# EAGLE design Transmitter (EAGLE 6.6.0)
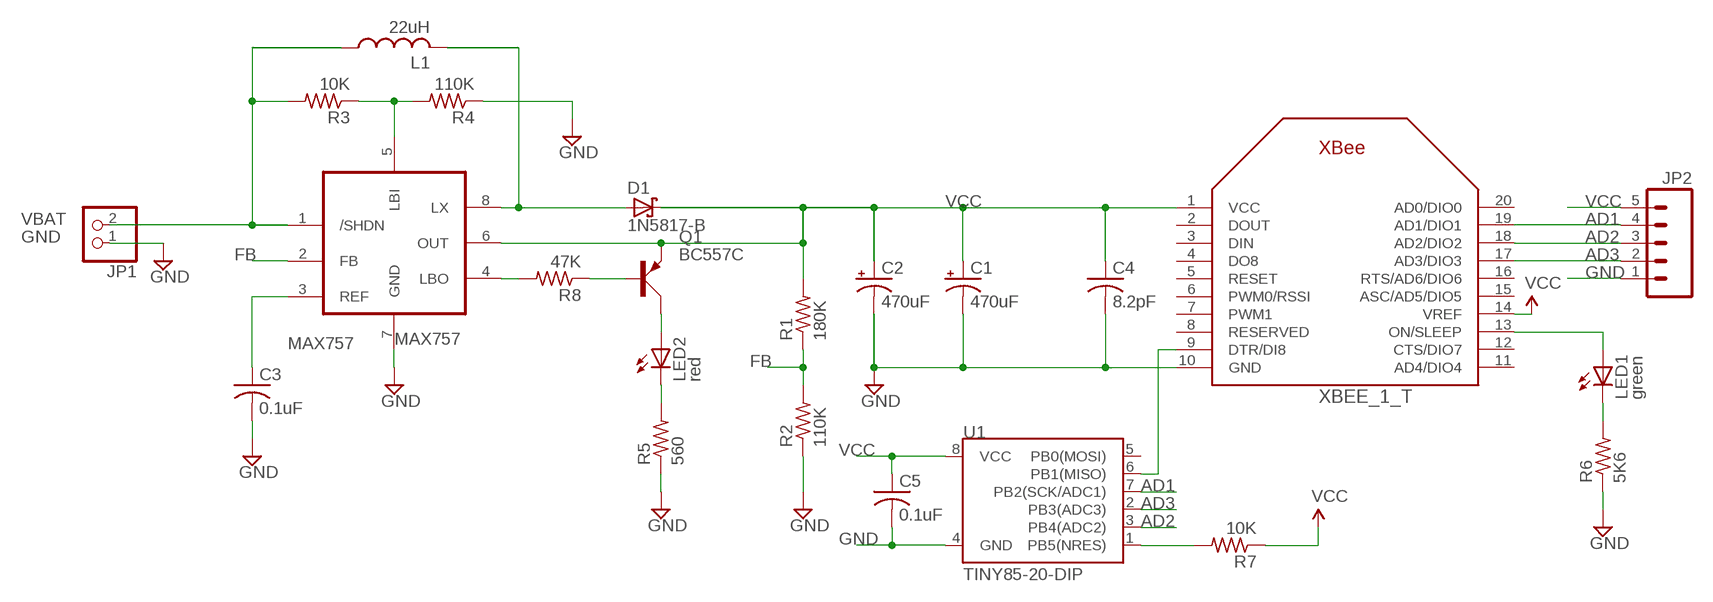
[diagram p0: schematic, sheet 1]

## Parts
C1  470uF  CPOL-USE3.5-8  [E3,5-8]
C2  470uF  CPOL-USE3.5-8  [E3,5-8]
C3  0.1uF  C-US025-024X044  [C025-024X044]
C4  8.2pF  C-US025-024X044  [C025-024X044]
C5  0.1uF  C-US025-024X044  [C025-024X044]
D1  1N5817-B  [DO41-7.6]
JP1  PINHD-1X2  [1X02]
JP2  M05PTH  [1X05]
L1  22uH  22R223C  [22R223C]
LED1  green  LED3MM  [LED3MM]
LED2  red  LED3MM  [LED3MM]
MAX757  MAX757  [DIL08]
Q1  BC557C  [TO92D]
R1  180K  R-US_0207/10  [0207/10]
R2  110K  R-US_0207/10  [0207/10]
R3  10K  R-US_0207/10  [0207/10]
R4  110K  R-US_0207/10  [0207/10]
R5  560  R-US_0207/10  [0207/10]
R6  5K6  R-US_0207/10  [0207/10]
R7  10K  R-US_0207/10  [0207/10]
R8  47K  R-US_0207/10  [0207/10]
U1  TINY85-20-DIP  ATTINY45TINY85-20-DIP  [DIP08]
XBEE_1_T  XBEE  [XBEE]

## Nets
AD1: JP2.4 U1.7(PB2(SCK/ADC1)) XBEE_1_T.19(AD1/DIO1)
AD2: JP2.3 U1.3(PB4(ADC2)) XBEE_1_T.18(AD2/DIO2)
AD3: JP2.2 U1.2(PB3(ADC3)) XBEE_1_T.17(AD3/DIO3)
FB: MAX757.2(FB) R1.1 R2.2
GND [power]: C1.- C2.- C3.2 C4.2 C5.2 JP1.1 JP2.1 MAX757.7(GND) R2.1 R4.1 R5.1 R6.1 U1.4(GND) XBEE_1_T.10(GND)
N$1: U1.6(PB1(MISO)) XBEE_1_T.9(DTR/DI8)
N$2: MAX757.4(LBO) R8.2
N$3: LED2.K(C) R5.2
N$4: LED1.A XBEE_1_T.13(ON/SLEEP)
N$5: LED1.K(C) R6.2
N$6: MAX757.5(LBI) R3.1 R4.2
N$7: D1.A L1.P$2 MAX757.8(LX)
N$8: C3.1 MAX757.3(REF)
N$9: Q1.B R8.1
N$10: R7.2 U1.1(PB5(NRES))
N$11: LED2.A Q1.C
VBAT [power]: JP1.2 L1.P$1 MAX757.1(/SHDN) R3.2
VCC [power]: C1.+ C2.+ C4.1 C5.1 D1.C JP2.5 MAX757.6(OUT) Q1.E R1.2 R7.1 U1.8(VCC) XBEE_1_T.1(VCC) XBEE_1_T.14(VREF)
Unconnected: U1.5(PB0(MOSI)) XBEE_1_T.2(DOUT) XBEE_1_T.3(DIN) XBEE_1_T.4(DO8) XBEE_1_T.5(RESET) XBEE_1_T.6(PWM0/RSSI) XBEE_1_T.7(PWM1) XBEE_1_T.8(RESERVED) XBEE_1_T.11(AD4/DIO4) XBEE_1_T.12(CTS/DIO7) XBEE_1_T.15(ASC/AD5/DIO5) XBEE_1_T.16(RTS/AD6/DIO6) XBEE_1_T.20(AD0/DIO0)

## Library data of the parts
C1 C2 = adafruit:CPOL-US: POLARIZED CAPACITOR, American symbol
C3-C5 = adafruit:C-US: CAPACITOR, American symbol
D1 = diode:1N581*: 1.0A SCHOTTKY BARRIER RECTIFIER Source: http://www.diodes.com/datasheets/ds23001.pdf
JP1 = pinhead:PINHD-1X2: PIN HEADER
JP2 = SparkFun-Connectors:M05: Header 5 Standard 5-pin 0.1" header. Use with straight break away headers (SKU : PRT-00116), right angle break away headers (PRT-00553), swiss pins (PRT-00743), machine pins (PRT-00117), and female headers (PRT-00115). Molex polarized connector foot print use with SKU : PRT-08230 with associated crimp pins and housings.
L1 = CuSTOM_GB:22R223C
LED1 LED2 = led:LED: LED OSRAM: - CHIPLED LG R971, LG N971, LY N971, LG Q971, LY Q971, LO R971, LY R971 LH N974, LH R974 LS Q976, LO Q976, LY Q976 LO Q996 - Hyper CHIPLED LW Q18S LB Q993, LB Q99A, LB R99A - SideLED LS A670, LO A670, LY A670, LG A670, LP A670 LB A673, LV A673, LT A673, LW A673 LH A674 LY A675 LS A676, LA A676, LO A676, LY A676, LW A676 LS A679, LY A679, LG A679 - Hyper Micro SIDELED® LS Y876, LA Y876, LO Y876, LY Y876 LT Y87S - SmartLED LW L88C, LW L88S LB L89C, LB L89S, LG L890 LS L89K, LO L89K, LY L89K LS L896, LA L896, LO L896, LY L896 - TOPLED LS T670, LO T670, LY T670, LG T670, LP T670 LSG T670, LSP T670, LSY T670, LOP T670, LYG T670 LG T671, LOG T671, LSG T671 LB T673, LV T673, LT T673, LW T673 LH T674 LS T676, LA T676, LO T676, LY T676, LB T676, LH T676, LSB T676, LW T676 LB T67C, LV T67C, LT T67C, LS T67K, LO T67K, LY T67K, LW E67C LS E67B, LA E67B, LO E67B, LY E67B, LB E67C, LV E67C, LT E67C LW T67C LS T679, LY T679, LG T679 LS T770, LO T770, LY T770, LG T770, LP T770 LB T773, LV T773, LT T773, LW T773 LH T774 LS E675, LA E675, LY E675, LS T675 LS T776, LA T776, LO T776, LY T776, LB T776 LHGB T686 LT T68C, LB T68C - Hyper Mini TOPLED® LB M676 - Mini TOPLED Santana® LG M470 LS M47K, LO M47K, LY M47K Source: http://www.osram.convergy.de LUXEON: - LUMILED® LXK2-PW12-R00, LXK2-PW12-S00, LXK2-PW14-U00, LXK2-PW14-V00 LXK2-PM12-R00, LXK2-PM12-S00, LXK2-PM14-U00 LXK2-PE12-Q00, LXK2-PE12-R00, LXK2-PE12-S00, LXK2-PE14-T00, LXK2-PE14-U00 LXK2-PB12-K00, LXK2-PB12-L00, LXK2-PB12-M00, LXK2-PB14-N00, LXK2-PB14-P00, LXK2-PB14-Q00 LXK2-PR12-L00, LXK2-PR12-M00, LXK2-PR14-Q00, LXK2-PR14-R00 LXK2-PD12-Q00, LXK2-PD12-R00, LXK2-PD12-S00 LXK2-PH12-R00, LXK2-PH12-S00 LXK2-PL12-P00, LXK2-PL12-Q00, LXK2-PL12-R00 Source: www.luxeon.com KINGBRIGHT: KA-3528ASYC Source: www.kingbright.com
MAX757 = adafruit:MAX757
Q1 = CuSTOM_GB:BC557C: PNP 557 Transistor (E - 1, B - 2, C - 3)
R1 R2 R4 R5 R8 = resistor:R-US_: RESISTOR, American symbol
R3 R6 R7 = rcl:R-US_: RESISTOR, American symbol
U1 = SparkFun-DigitalIC:ATTINY45: Atmel 8-pin 2/4/8kB flash uC; PROD_ID: IC-09445
XBEE_1_T = adafruit:XBEE

## Net classes
0 signal: width 0.203 mm, drill 0.508 mm, clearance 0.254 mm
1 power: width 0.305 mm, drill 0.508 mm, clearance 0.508 mm

## Board
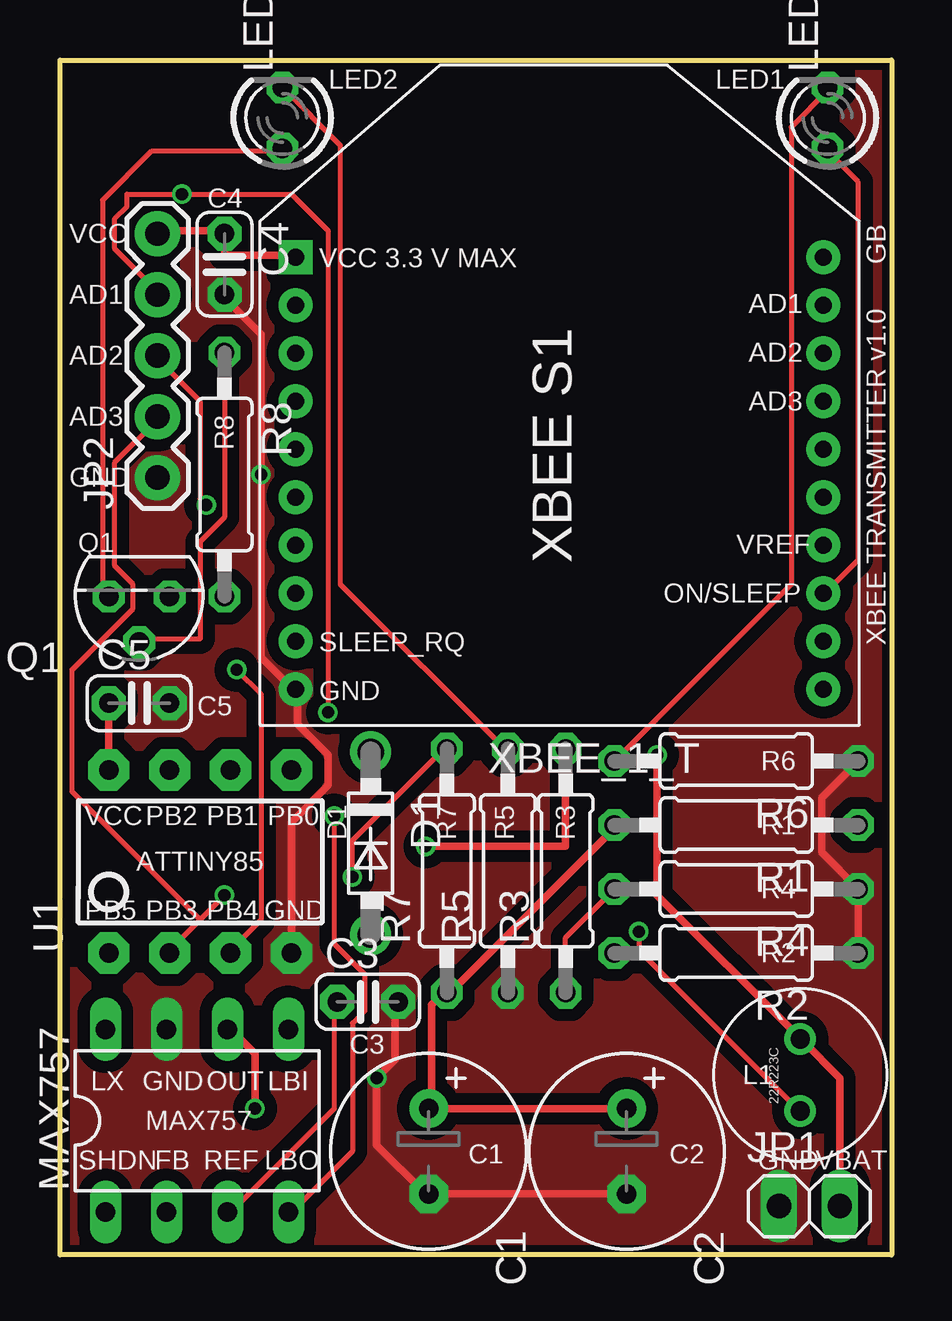
[diagram p1: board, top side]
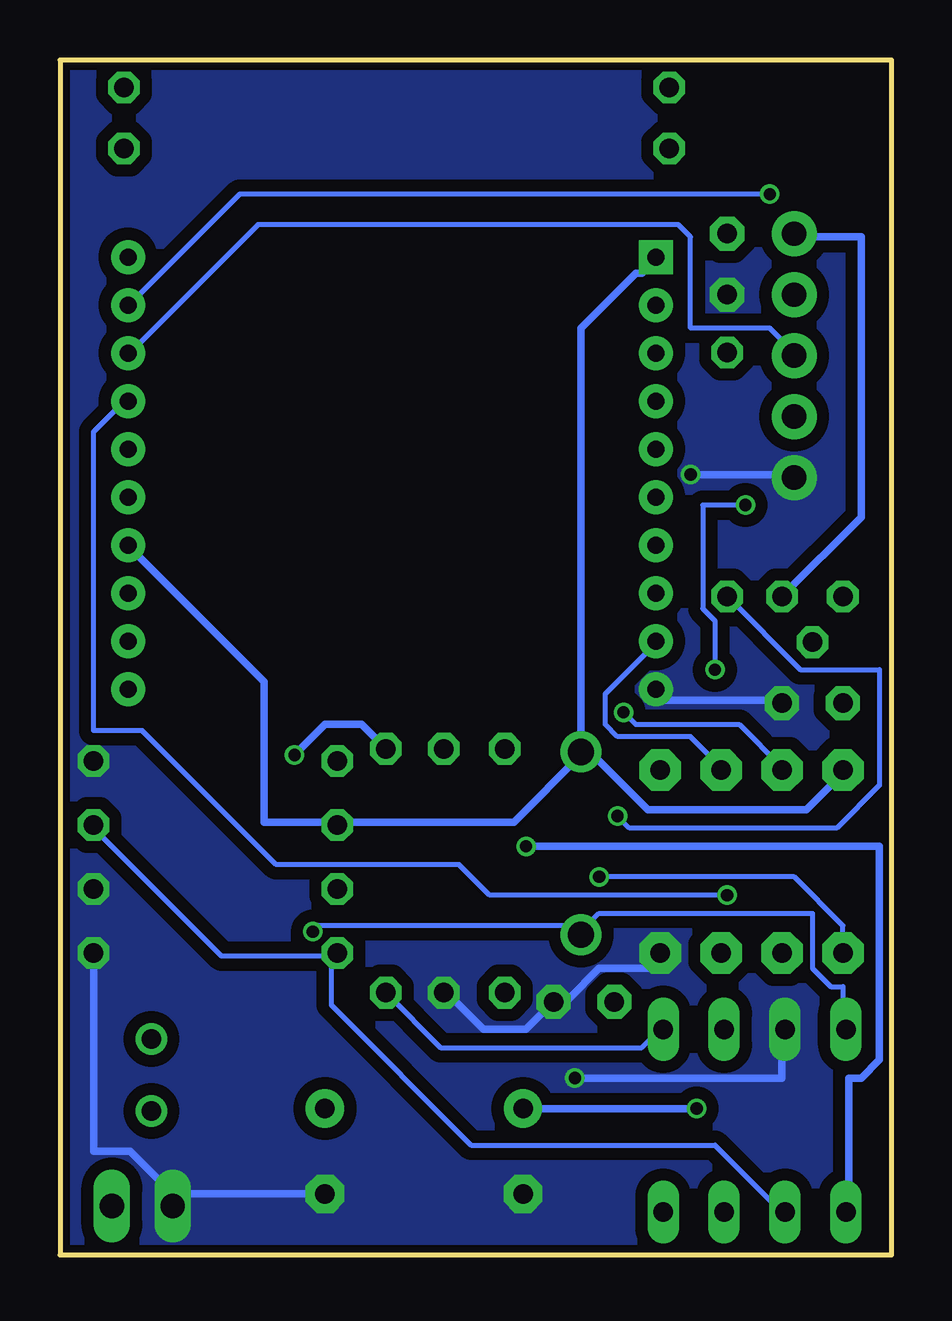
[diagram p2: board, bottom side, seen from below]

Size 34.67 x 49.78 mm. Coordinates in mm from the lower left corner, seen from the top.
Outline: 0,49.78 34.67,49.78 34.67,0 0,0 0,49.78
Copper layers (1*16): Top 0.035mm / dielectric 1.5mm / Bottom 0.035mm
Design rules "SeeedStudio_2layer_DRU_no_angle_20140221": minimum track width 6mil, minimum drill 12mil, track to track 6mil, track to pad 6mil, pad to pad 6mil, via to via 6mil, smd to smd 0mil, copper to edge 10mil, drill to drill 10mil, minimum pad ring 10mil, minimum via ring 6mil, stop-mask expansion 2mil, vias tented up to drill 100mil, thermal gap 10mil

### Footprints (pad centres in the part's own frame; a part is rotated, then mirrored left to right if it is on the bottom)
E3,5-8 = drill 0.813 pad 1.6: + -1.778,0 | drill 0.813 pad 1.6 octagon: - 1.778,0
C025-024X044 = drill 0.813 pad 1.422 octagon: 1 -1.27,0; 2 1.27,0
DO41-7.6 = drill 1.1 pad 1.7: A 3.81,0; C -3.81,0
1X02 = drill 1.016 long: 1 -1.27,0; 2 1.27,0
1X05 = drill 1.016 pad 1.88: 1 0,0; 2 2.54,0; 3 5.08,0; 4 7.62,0; 5 10.16,0
22R223C = drill 0.8 pad 1.27: P$1 1.5,0; P$2 -1.5,0
LED3MM = drill 0.813 octagon: A -1.27,0; K 1.27,0
DIL08 = drill 0.813 long: 1 -3.81,-3.81; 2 -1.27,-3.81; 3 1.27,-3.81; 4 3.81,-3.81; 5 3.81,3.81; 6 1.27,3.81; 7 -1.27,3.81; 8 -3.81,3.81
TO92D = drill 0.813 octagon: B 0,1.905; C 1.27,0; E -1.27,0
0207/10 = drill 0.813 octagon: 1 -5.08,0; 2 5.08,0
DIP08 = drill 0.813 pad 1.727 octagon: 1 -3.81,-3.81; 2 -1.27,-3.81; 3 1.27,-3.81; 4 3.81,-3.81; 5 3.81,3.81; 6 1.27,3.81; 7 -1.27,3.81; 8 -3.81,3.81
XBEE = drill 0.7 pad 1.422 square: 1 -11,5.5 | drill 0.7 pad 1.422: 2 -11,3.5; 3 -11,1.5; 4 -11,-0.5; 5 -11,-2.5; 6 -11,-4.5; 7 -11,-6.5; 8 -11,-8.5; 9 -11,-10.5; 10 -11,-12.5; 11 11,-12.5; 12 11,-10.5; 13 11,-8.5; 14 11,-6.5; 15 11,-4.5; 16 11,-2.5; 17 11,-0.5; 18 11,1.5; 19 11,3.5; 20 11,5.5

### Placement (x,y rotation side)
C1  15.37,4.32 270 top
C2  23.62,4.32 270 top
C3  12.83,10.54 0 top
C4  6.86,41.28 270 top
C5  3.3,22.99 0 top
D1  12.95,17.14 270 top
JP1  31.24,2.03 0 top
JP2  4.06,32.39 90 top
L1  30.86,7.49 90 top
LED1  32,47.37 90 top
LED2  9.27,47.37 90 top
MAX757  5.71,5.59 0 top
Q1  3.3,27.43 180 top
R1  28.19,17.91 180 top
R2  28.19,12.57 180 top
R3  21.08,16 90 top
R4  28.19,15.24 180 top
R5  18.67,16 90 top
R6  28.19,20.57 180 top
R7  16.13,16 90 top
R8  6.86,32.51 270 top
U1  5.84,16.38 0 top
XBEE_1_T  20.83,36.07 0 top

### Tracks (layer width: path | path; a pad name or v marks a point on that pad's centre or on a via)
AD1  (via drill 0.51)
  Top 0.203: JP2.4 4.06,40.13 2.29,41.91 2.29,43.18 2.79,43.69 2.79,44.2 v5.08,44.2 9.65,44.2 11.18,42.67 v11.18,22.61
  Bottom 0.203: v5.08,44.2 27.18,44.2 31.75,39.62 XBEE_1_T.19 | v11.18,22.61 10.67,22.1 6.35,22.1 4.57,20.32 U1.7
AD2  (via drill 0.51)
  Top 0.203: v7.37,24.38 8.38,23.37 8.38,13.97 7.11,12.7 U1.3 | v6.1,31.24 5.84,31.5 5.84,35.56 4.06,37.34 JP2.3
  Bottom 0.203: XBEE_1_T.18 31.75,37.59 26.42,42.93 8.89,42.93 8.38,42.42 8.38,38.61 5.08,38.61 4.06,37.59 JP2.3 | v7.37,24.38 7.37,26.42 7.87,26.92 7.87,31.24 v6.1,31.24
AD3  (via drill 0.51)
  Top 0.203: 5.84,13.97 4.57,12.7 U1.2 | 5.84,13.97 v6.86,14.99 | 5.84,13.97 0.51,19.3 0.51,24.38 3.05,26.92 3.05,27.94 2.29,28.7 2.29,33.02 4.06,34.8 JP2.2
  Bottom 0.203: v6.86,14.99 16.76,14.99 18.03,16.26 25.65,16.26 31.24,21.84 33.27,21.84 33.27,34.29 32,35.56 XBEE_1_T.17
FB
  Bottom 0.203: 23.37,12.45 23.37,10.41 17.53,4.57 7.37,4.57 4.57,1.78 MAX757.2 | 23.37,12.45 23.11,12.45 R2.2 23.37,12.45 | 23.37,12.45 27.94,12.45 33.27,17.78 R1.1
GND  (via drill 0.51)
  Top 0.305: R2.1 R4.1 31.75,16.76 31.75,19.05 R6.1 | C4.2 6.86,39.88 8.38,38.35 v8.38,32.51 8.38,24.89 9.65,23.62 XBEE_1_T.10 9.91,23.37 9.91,22.1 11.18,20.83 11.18,19.56 9.65,18.03 U1.4 | C3.2 13.97,10.41 13.97,8.13 v13.21,7.37 13.21,4.57 15.24,2.54 C1.- C2.-
  Bottom 0.305: 29.72,2.29 29.46,2.54 C2.- | R2.1 33.27,4.32 31.75,4.32 29.72,2.29 | 29.72,2.29 JP1.1 | C5.2 4.57,23.11 9.4,23.11 9.65,23.37 XBEE_1_T.10 | v8.38,32.51 4.06,32.51 JP2.1 | v13.21,7.37 4.57,7.37 4.57,9.4 MAX757.7 | R5.1 18.54,10.92 17.02,9.4 15.24,9.4 C3.2 13.97,10.67 13.46,10.67 12.19,11.94 10.16,11.94 9.65,12.45 U1.4
  pour Bottom (isolate 0.305, no thermals): 0,49.78 34.67,49.78 34.67,0 0,0
  pour Top (isolate 0.305, no thermals): 0,49.78 34.67,49.78 34.67,0 0,0
N$1
  Bottom 0.203: XBEE_1_T.9 9.91,25.4 11.94,23.37 11.94,22.1 11.43,21.59 8.38,21.59 7.11,20.32 U1.6
N$2  (via drill 0.51)
  Top 0.203: v11.43,18.29 11.43,12.95 12.7,11.68 12.7,10.16 12.19,9.65 12.19,4.32 9.65,1.78 MAX757.4
  Bottom 0.203: v11.43,18.29 10.92,17.78 2.29,17.78 0.51,19.56 0.51,24.38 3.81,24.38 R8.2
N$3
  Top 0.203: LED2.K 11.68,46.23 11.68,27.94 18.54,21.08 R5.2
N$4
  Top 0.203: LED1.A 32,45.97 33.27,44.7 33.27,28.96 32,27.69 XBEE_1_T.13
N$5
  Top 0.203: R6.2 30.48,27.94 30.48,46.99 32,48.51 LED1.K
N$6
  Top 0.203: R4.2 21.08,13.21 R3.1
  Bottom 0.203: R3.1 18.8,8.64 10.41,8.64 9.65,9.4 MAX757.5
N$7  (via drill 0.51)
  Top 0.203: v24.13,13.46 24.13,12.7 30.73,6.1 L1.P$2
  Bottom 0.203: v24.13,13.46 23.88,13.72 13.21,13.72 12.95,13.46 | 12.95,13.46 12.19,14.22 3.3,14.22 3.3,11.94 2.54,11.18 2.03,11.18 2.03,9.4 MAX757.8 | 12.95,13.46 D1.A
N$8
  Top 0.203: MAX757.3 7.11,1.78 11.43,6.1 11.43,10.41 C3.1
N$9
  Top 0.203: R8.1 6.86,30.73 5.84,29.72 5.84,25.65 3.3,25.65 Q1.B
N$10  (via drill 0.51)
  Top 0.203: v12.19,15.75 12.19,17.27 16,21.08 R7.2
  Bottom 0.203: v12.19,15.75 4.06,15.75 2.03,13.72 U1.1
N$11
  Top 0.203: Q1.C 1.78,27.69 1.78,43.94 3.81,45.97 9.14,45.97 LED2.A
VBAT  (via drill 0.51)
  Top 0.305: JP1.2 32.51,7.37 30.99,8.89 L1.P$1 30.73,9.14 24.89,14.99 v24.89,20.83 | v15.24,17.02 21.08,17.02 R3.2
  Bottom 0.305: v15.24,17.02 0.51,17.02 0.51,8.13 1.27,7.37 1.78,7.37 1.78,1.78 MAX757.1 | v24.89,20.83 23.62,22.1 22.1,22.1 R3.2
VCC  (via drill 0.51)
  Top 0.305: JP2.5 4.06,42.67 6.86,42.67 C4.1 6.86,41.66 9.65,41.66 XBEE_1_T.1 | U1.8 C5.1 | v8.13,6.1 8.13,8.38 7.11,9.4 MAX757.6 | 15.49,6.1 15.49,10.41 16,10.92 R7.1 16.26,10.92 23.11,17.78 R1.2 | 15.49,6.1 C2.+ | 15.49,6.1 C1.+
  Bottom 0.305: Q1.E 1.27,30.73 1.27,42.42 4.06,42.42 JP2.5 | C1.+ v8.13,6.1 | 23.11,18.03 26.16,18.03 26.16,23.88 31.75,29.46 XBEE_1_T.14 | 12.95,20.83 15.75,18.03 23.11,18.03 | 23.11,18.03 R1.2 | 12.95,20.83 12.45,20.83 10.16,18.54 3.56,18.54 2.03,20.07 U1.8 | 12.95,20.83 D1.C 12.95,38.61 10.67,40.89 10.41,40.89 9.91,41.4 XBEE_1_T.1

### Text on the board
tPlace: LED2 | LED1 | C4 | VCC | VCC 3.3 V MAX | GB | AD1 | AD1 | AD2 | AD2 | AD3 | AD3 | R8 | GND | Q1 | XBEE S1 | VREF | ON/SLEEP | SLEEP_RQ | XBEE TRANSMITTER v1.0 | GND | C5 | R6 | VCC | PB2 | PB1 | PB0 | D1 | R7 | R5 | R3 | R1 | ATTINY85 | R4 | PB5 | PB3 | PB4 | GND | R2 | C3 | LX | GND | OUT | LBI | L1 | MAX757 | C1 | C2 | SHDN | FB | REF | LBO | GND | VBAT